# EAGLE design Rotary-Buttons (EAGLE 9.6.2)
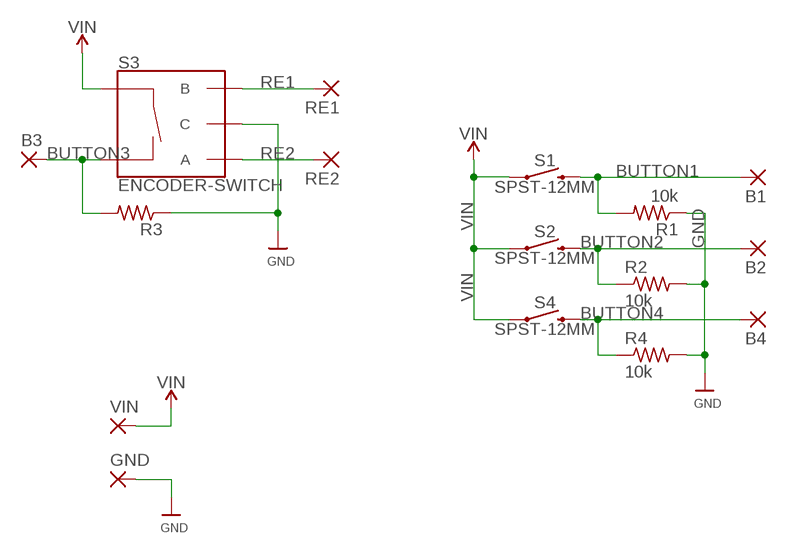
[diagram p0: schematic, sheet 1]

## Parts
B1  SMD5  [SMD2,54-5,08]
B2  SMD5  [SMD2,54-5,08]
B3  SMD5  [SMD2,54-5,08]
B4  SMD5  [SMD2,54-5,08]
GND  SMD5  [SMD2,54-5,08]
R1  10k  R-US_R1206  [R1206]
R2  10k  R-US_R1206  [R1206]
R3  R-US_R1206  [R1206]
R4  10k  R-US_R1206  [R1206]
RE1  SMD5  [SMD2,54-5,08]
RE2  SMD5  [SMD2,54-5,08]
S1  SPST-12MM  MOMENTARY-SWITCH-SPST-PTH-12MM  [TACTILE_SWITCH_PTH_12MM]
S2  SPST-12MM  MOMENTARY-SWITCH-SPST-PTH-12MM  [TACTILE_SWITCH_PTH_12MM]
S3  ENCODER-SWITCH  [ROTARY_ENC_PLAIN]
S4  SPST-12MM  MOMENTARY-SWITCH-SPST-PTH-12MM  [TACTILE_SWITCH_PTH_12MM]
VIN  SMD5  [SMD2,54-5,08]

## Nets
BUTTON1: B1.1(P) R1.2 S1.3
BUTTON2: B2.1(P) R2.1 S2.3
BUTTON3: B3.1(P) R3.2 S3.SW-
BUTTON4: B4.1(P) R4.1 S4.3
GND: GND.1(P) R1.1 R2.2 R3.1 R4.2 S3.C
RE1: RE1.1(P) S3.B
RE2: RE2.1(P) S3.A
VIN: S1.1 S2.1 S3.SW+ S4.1 VIN.1(P)

## Library data of the parts
B1-B4 GND RE1 RE2 VIN = wirepad:SMD5: SMD PAD
R1-R4 = adafruit:R-US_: RESISTOR, American symbol
S1 S2 S4 = SparkFun-Switches:MOMENTARY-SWITCH-SPST: Momentary Switch (Pushbutton) - SPST Normally-open (NO) SPST momentary switches (buttons, pushbuttons). Variants PTH-12MM - 12mm square, through-hole Momentary Pushbutton Switch - 12mm Square <https://www.sparkfun.com/products/9190> (COM-09190) PTH-6.0MM, PTH-6.0MM-KIT - 6.0mm square, through-hole Mini Pushbutton Switch <https://www.sparkfun.com/products/97> (COM-00097) KIT package intended for soldering kit's - only one side of pads' copper is exposed. PTH-RIGHT-ANGLE-KIT - Right-angle, through-hole Right Angle Tactile Button <https://www.sparkfun.com/products/10791> - Used on SparkFun BigTime Watch Kit <https://www.sparkfun.com/products/11734> SMD-12MM - 12mm square, surface-mount Tactile Button - SMD (12mm) <https://www.sparkfun.com/products/12993> (COM-12993) Used on SparkFun PicoBoard <https://www.sparkfun.com/products/11888> SMD-4.5MM - 4.5mm Square Trackball Switch Used on SparkFun Blackberry Trackballer Breakout <https://www.sparkfun.com/products/13169> SMD-4.6MMX2.8MM - 4.60mm x 2.80mm, surface mount Used on SparkFun SAMD21 Mini Breakout <https://www.sparkfun.com/products/13664> SMD-5.2MM, SMD-5.2-REDUNDANT - 5.2mm square, surface-mount Mini Pushbutton Switch - SMD <https://www.sparkfun.com/products/8720> (COM-08720) Used on Arduino Pro Mini <https://www.sparkfun.com/products/11114> REDUNDANT package connects both switch circuits together SMD-6.0X3.5MM - 6.0 x 3.5mm, surface mount Momentary Reset Switch SMD <https://www.sparkfun.com/products/8229> (COM-08229) SMD-6.2MM-TALL - 6.2mm square, surface mount Tactile Button - SMD (6mm) <https://www.sparkfun.com/products/12992> Used on SparkFun Digital Sandbox <https://www.sparkfun.com/products/12651> SMD-RIGHT-ANGLE - Right-angle, surface mount Used on SparkFun Block for Intel® Edison - Arduino <https://www.sparkfun.com/products/13036>; PROD_ID: SWCH-09185; SF_SKU: COM-09190
S3 = SparkFun-Switches:ENCODER-SWITCH: Rotary Encoder w/ Select Switch Encoders rotate similarly to potentiometers, but they’re different from potentiometers in that an encoder has full rotation without limits. They output gray code so that you can tell how much and in which direction the encoder has been turned. This encoder includes a push-down select switch built into the shaft. SparkFun Products Rotary Encoder <https://www.sparkfun.com/products/9117> (COM-09117); SF_SKU: COM-09117

## Board
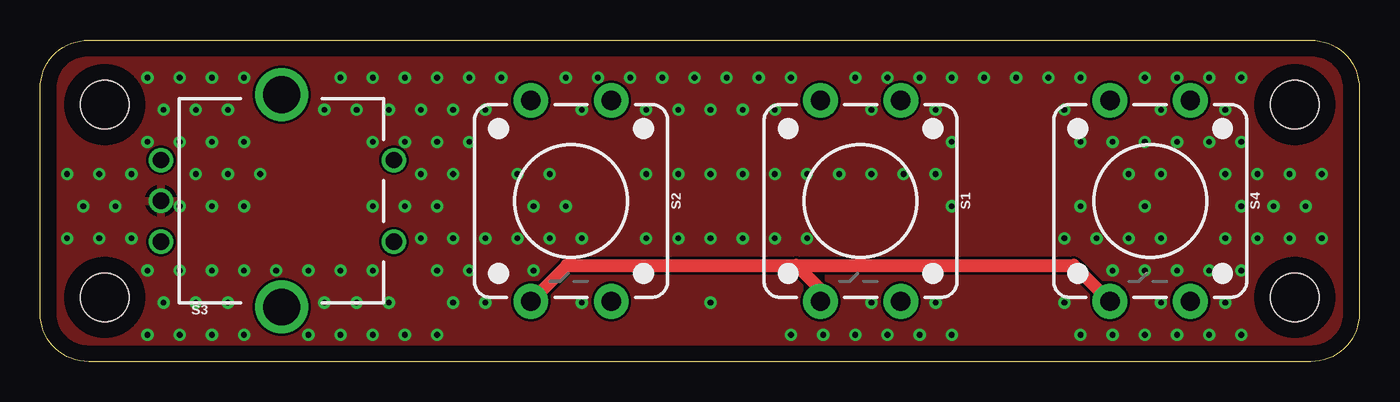
[diagram p1: board, top side]
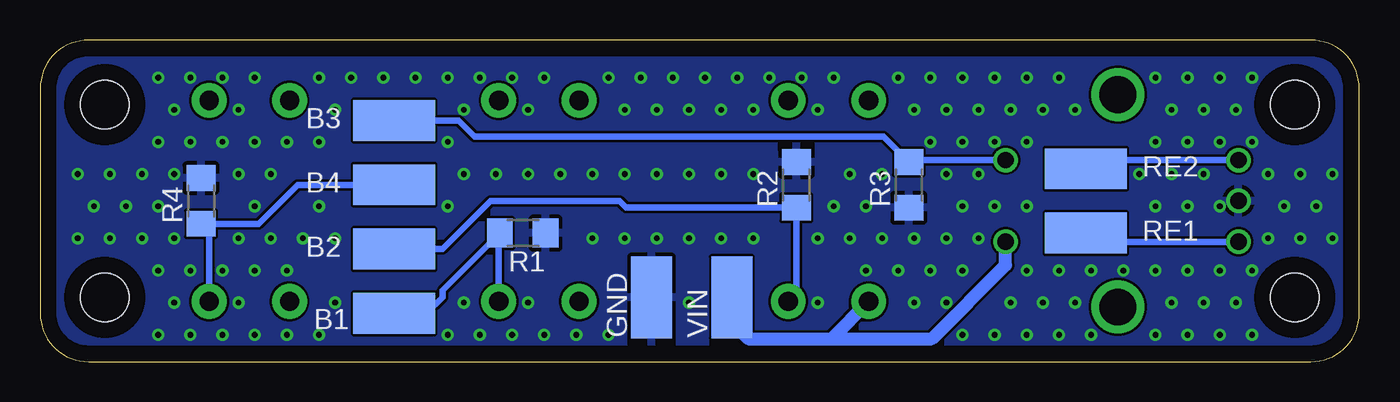
[diagram p2: board, bottom side, seen from below]

Size 82 x 20 mm. Coordinates in mm from the lower left corner, seen from the top.
Outline: 79,0 3,0 arc-90 0,3 0,17 arc-90 3,20 79,20 arc-90 82,17 82,3 arc-90 79,0
Copper layers (1*16): Top 0.035mm / dielectric 1.5mm / Bottom 0.035mm
Design rules "default": minimum track width 6mil, minimum drill 0.35mm, track to track 6mil, track to pad 6mil, pad to pad 6mil, via to via 6mil, smd to smd 6mil, copper to edge 40mil, drill to drill 6mil, minimum pad ring 10mil, minimum via ring 8mil, stop-mask expansion 4mil, vias tented up to drill 0.5mm, thermal gap 10mil
Holes 3 mm at 4,16 4,4 78,16 78,4

### Footprints (pad centres in the part's own frame; a part is rotated, then mirrored left to right if it is on the bottom)
SMD2,54-5,08 = smd 2.54 x 5.08: 1 0,0
R1206 = smd 1.6 x 1.803: 1 -1.422,0; 2 1.422,0
TACTILE_SWITCH_PTH_12MM = drill 1.2 pad 2.159: 1 6.25,-2.5; 2 -6.25,-2.5; 3 6.25,2.5; 4 -6.25,2.5
ROTARY_ENC_PLAIN = drill 1.016: A 7.493,-2.54; B 7.493,2.54; C 7.493,0; SW+ -6.985,2.54; SW- -6.985,-2.54 | drill 2.286: P$3 0,6.604; P$4 0,-6.604

### Placement (x,y rotation side)
B1  60,3 270 bottom
B2  60,7 270 bottom
B3  60,15 270 bottom
B4  60,11 270 bottom
GND  44,4 0 bottom
R1  52,8 180 bottom
R2  35,11 90 bottom
R3  28,11 90 bottom
R4  72,10 90 bottom
RE1  17,8 270 bottom
RE2  17,12 270 bottom
S1  51,10 270 top
S2  33,10 270 top
S3  15,10 180 top
S4  69,10 270 top
VIN  39,4 0 bottom

### Tracks (layer width: path | path; a pad name or v marks a point on that pad's centre or on a via)
BUTTON1
  Bottom 0.406: B1.1 58,3 57,4 57,4.42 R1.2 53.5,7.92 S1.3
BUTTON2
  Bottom 0.406: S2.3 35,4.25 R2.1 45.58,9.58 46,10 54,10 57,7 B2.1
BUTTON3
  Bottom 0.406: S3.SW- 27.88,12.54 R3.2 29.58,14 55,14 56,15 B3.1
BUTTON4
  Bottom 0.406: B4.1 66,11 68.42,8.58 R4.1 71.5,8.08 S4.3
GND  (via drill 0.35)
  other vias: 1.67,7.67 2.67,9.67 1.67,11.67 3.67,7.67 4.67,9.67 3.67,11.67 6.67,1.67 6.67,5.67 5.67,7.67 5.67,11.67 6.67,13.67 6.67,17.67 8.67,1.67 7.67,3.67 8.67,5.67 8.67,9.67 8.67,13.67 7.67,15.67 8.67,17.67 10.67,1.67 9.67,3.67 10.67,5.67 10.67,9.67 9.67,11.67 10.67,13.67 9.67,15.67 10.67,17.67 12.67,1.67 11.67,3.67 12.67,5.67 12.67,9.67 11.67,11.67 12.67,13.67 11.67,15.67 12.67,17.67 14.67,5.67 13.67,11.67 16.67,1.67 16.67,5.67 18.67,1.67 17.67,3.67 18.67,5.67 17.67,15.67 18.67,17.67 20.67,1.67 19.67,3.67 20.67,5.67 20.67,9.67 20.67,13.67 19.67,15.67 20.67,17.67 22.67,1.67 21.67,3.67 22.67,9.67 22.67,13.67 21.67,15.67 22.67,17.67 24.67,1.67 24.67,5.67 23.67,7.67 24.67,9.67 23.67,11.67 24.67,13.67 23.67,15.67 24.67,17.67 25.67,3.67 26.67,5.67 25.67,7.67 25.67,11.67 26.67,13.67 25.67,15.67 26.67,17.67 27.67,3.67 28.67,5.67 27.67,7.67 27.67,15.67 28.67,17.67 30.67,5.67 29.67,7.67 30.67,9.67 29.67,11.67 31.67,7.67 32.67,9.67 31.67,11.67 32.67,17.67 33.67,3.67 33.67,7.67 33.67,15.67 34.67,17.67 36.67,17.67 37.67,7.67 37.67,11.67 37.67,15.67 38.67,17.67 39.67,7.67 39.67,11.67 39.67,15.67 40.67,17.67 41.67,3.67 41.67,7.67 41.67,11.67 41.67,15.67 42.67,17.67 43.67,7.67 43.67,11.67 43.67,15.67 44.67,17.67 46.67,1.67 45.67,7.67 45.67,11.67 45.67,15.67 46.67,17.67 48.67,1.67 47.67,7.67 47.67,11.67 50.67,1.67 49.67,11.67 50.67,17.67 52.67,1.67 51.67,3.67 51.67,11.67 51.67,15.67 52.67,17.67 54.67,1.67 53.67,11.67 54.67,17.67 56.67,1.67 55.67,3.67 56.67,9.67 55.67,11.67 56.67,13.67 55.67,15.67 56.67,17.67 58.67,17.67 60.67,17.67 62.67,17.67 64.67,1.67 63.67,3.67 63.67,7.67 64.67,9.67 64.67,13.67 63.67,15.67 64.67,17.67 66.67,1.67 66.67,5.67 65.67,7.67 66.67,13.67 68.67,1.67 68.67,5.67 67.67,7.67 68.67,9.67 67.67,11.67 68.67,13.67 68.67,17.67 70.67,1.67 69.67,3.67 70.67,5.67 69.67,7.67 69.67,11.67 70.67,13.67 69.67,15.67 70.67,17.67 72.67,1.67 72.67,5.67 72.67,13.67 72.67,17.67 74.67,1.67 73.67,3.67 74.67,5.67 73.67,7.67 74.67,9.67 73.67,11.67 74.67,13.67 73.67,15.67 74.67,17.67 75.67,7.67 76.67,9.67 75.67,11.67 77.67,7.67 78.67,9.67 77.67,11.67 79.67,7.67 79.67,11.67
  pour Top: 0,0 0,20 82,20 82,0
  pour Bottom: 0,0 0,20 82,20 82,0
RE1
  Bottom 0.406: RE1.1 16.46,7.46 S3.B
RE2
  Bottom 0.406: S3.A 16.46,12.54 RE2.1
VIN
  Top 0.813: S2.1 32.75,6 47,6 | S4.1 64.25,6 47,6 | 47,6 48.5,4.5 S1.1
  Bottom 0.813: VIN.1 39,2.42 38,1.42 32.83,1.42 | 32.83,1.42 S2.1 | 32.83,1.42 26.58,1.42 21.98,6.01 S3.SW+